# Altium schematic sheet 0.2.SchDoc
size A4
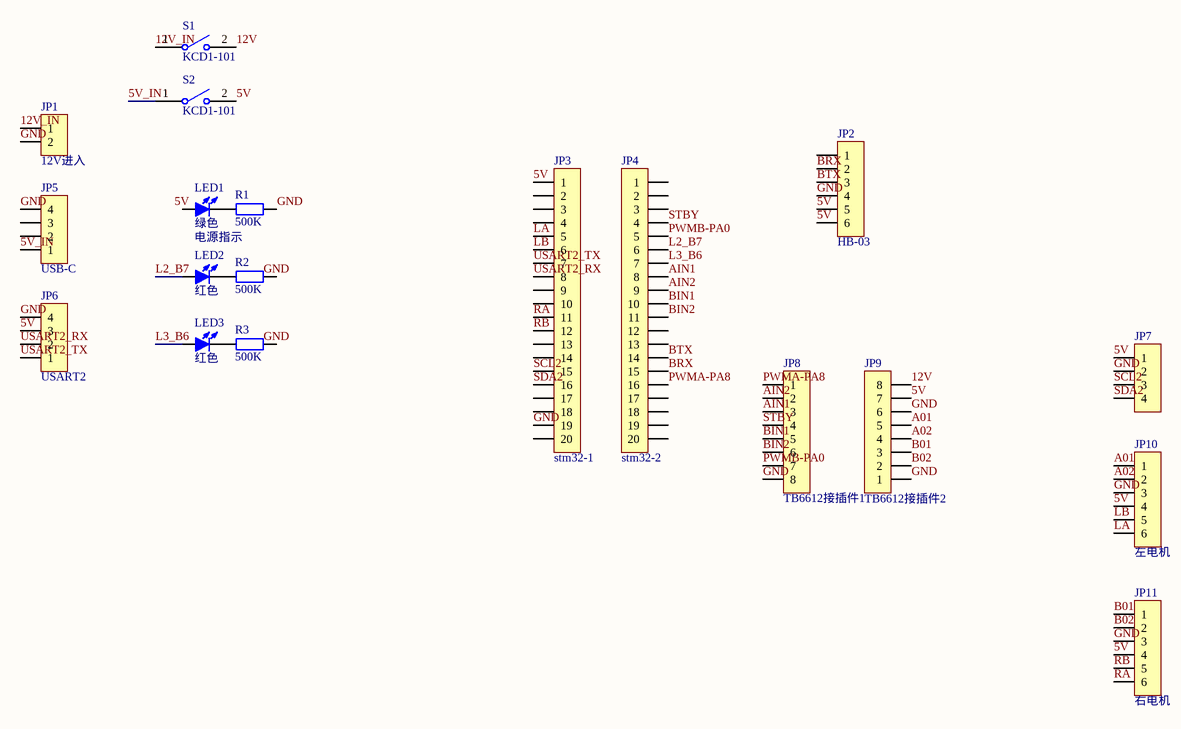
[diagram p0: 0.2.SchDoc]

## Parts
JP1  BOM名称: 12V进入  [KF2EDGK5.08-LI-2P]  (hidden comment: HDR-1X2)
JP2  BOM名称: HB-03  [HDR2.54-M-LI-6P]  (hidden comment: HDR-1X6)
JP3  BOM名称: stm32-1  [HDR2.54-M-LI-20P]  (hidden comment: HDR-1X20)
JP4  BOM名称: stm32-2  [HDR2.54-M-LI-20P]  (hidden comment: HDR-1X20)
JP5  BOM名称: USB-C  [HDR2.54-M-LI-4P]  (hidden comment: HDR-1X4)
JP6  BOM名称: USART2  [HDR2.54-M-LI-4P]  (hidden comment: HDR-1X4)
JP7  HDR-1X4  [XH2.54-WI-4P]  (value not drawn)
JP8  BOM名称: TB6612接插件1  [HDR2.54-M-LI-8P]  (hidden comment: HDR-1X8)
JP9  BOM名称: TB6612接插件2  [HDR2.54-M-LI-8P]  (hidden comment: HDR-1X8)
JP10  BOM名称: 左电机  [KF128-5.08-6P]  (hidden comment: HDR-1X6)
JP11  BOM名称: 右电机  [KF128-5.08-6P]  (hidden comment: HDR-1X6)
LED1  绿色  BOM名称: 电源指示  [LED 0805G]
LED2  红色  [LED 0805G]
LED3  红色  [LED 0805G]
R1  500K  [R 0805_M]
R2  500K  [R 0805_M]
R3  500K  [R 0805_M]
S1  KCD1-101  [KCD1-101]
S2  KCD1-101  [KCD1-101]

## Nets
5V: JP2.5 JP2.6 JP3.1 JP6.3 JP7.1 JP9.7 JP10.4 JP11.4 LED1.1(A) S2.2
5V_IN: JP5.1 S2.1
12V: JP9.8 S1.2
12V_IN: JP1.1 S1.1
A01: JP9.5 JP10.1
A02: JP9.4 JP10.2
AIN1: JP4.8 JP8.3
AIN2: JP4.9 JP8.2
B01: JP9.3 JP11.1
B02: JP9.2 JP11.2
BIN1: JP4.10 JP8.5
BIN2: JP4.11 JP8.6
BRX: JP2.2 JP4.15
BTX: JP2.3 JP4.14
GND: JP1.2 JP2.4 JP3.19 JP5.4 JP6.4 JP7.2 JP8.8 JP9.1 JP9.6 JP10.3 JP11.3 R1.2 R2.2 R3.2
L2_B7: JP4.6 LED2.1(A)
L3_B6: JP4.7 LED3.1(A)
LA: JP3.5 JP10.6
LB: JP3.6 JP10.5
PWMA-PA8: JP4.16 JP8.1
PWMB-PA0: JP4.5 JP8.7
RA: JP3.11 JP11.6
RB: JP3.12 JP11.5
SCL2: JP3.15 JP7.3
SDA2: JP3.16 JP7.4
STBY: JP4.4 JP8.4
USART2_RX: JP3.8 JP6.2
USART2_TX: JP3.7 JP6.1
NetLED1_2: LED1.2(K) R1.1
NetLED2_2: LED2.2(K) R2.1
NetLED3_2: LED3.2(K) R3.1

Not connected (* = marked no-connect by the designer): JP2 1; JP3 2 3 4 9 10 13 14 17 18 20; JP4 1 2 3 12 13 17 18 19 20; JP5 2 3

## Library data of the parts
JP1 = Header 2: 2P接插件; 版权归属: 源创客; 学习资源: www.ooocke.com
JP2 = Header 6: 6P接插件; 版权归属: 封装库来自淘宝 ID：黄晶宝石; 学习资源: https://shop463601444.taobao.com
JP3 JP4 = Header 20: 20P接插件; 版权归属: 封装库来自淘宝 ID：黄晶宝石; 学习资源: https://shop463601444.taobao.com
JP5-JP7 = Header 4: 4P接插件; 版权归属: 封装库来自淘宝 ID：黄晶宝石; 学习资源: https://shop463601444.taobao.com
JP8 JP9 = Header 8: 8P接插件; 版权归属: 封装库来自淘宝 ID：黄晶宝石; 学习资源: https://shop463601444.taobao.com
JP10 JP11 = Header 6: 6P接插件; 版权归属: 源创客; 学习资源: www.ooocke.com
LED1-LED3 = LED-SMD: 贴片LED; 版权归属: 源创客; 学习资源: www.ooocke.com
  LED2 LED3: BOM名称: 贴片LED
R1-R3 = R: 贴片电阻; 版权归属: 来自淘宝 ID：黄晶宝石; BOM名称: 贴片电阻; 联系售后: https://shop463601444.taobao.com
  R2: ComponentLink1Description: New link; ComponentLink1URL: *
S1 S2 = KCD1-101: 1路单刀船型开关; 版权归属: 封装库来自淘宝 ID：黄晶宝石; BOM名称: 1路单刀船型开关; 学习资源: www.ooocke.com